# Altium schematic sheet 项目9.SchDoc
size A4
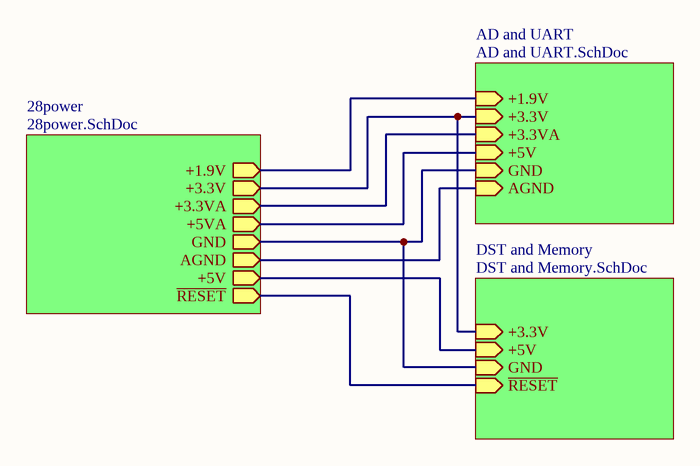
[diagram p0: 项目9.SchDoc]

## Sub-sheets
28power = 28power.SchDoc: +3.3V (out), +3.3VA (out), +5VA (out), GND (out), AGND (out), +5V (out), ~{RESET} (out), +1.9V (out)
AD and UART = AD and UART.SchDoc: +1.9V (in), +3.3V (in), +3.3VA (in), +5V (in), GND (in), AGND (in)
DST and Memory = DST and Memory.SchDoc: +3.3V (in), +5V (in), GND (in), ~{RESET} (in)

## Nets
(unnamed): sheet 28power/+3.3V, sheet AD and UART/+3.3V, sheet DST and Memory/+3.3V
(unnamed): sheet 28power/+3.3VA, sheet AD and UART/+3.3VA
(unnamed): sheet 28power/+5VA, sheet AD and UART/+5V
(unnamed): sheet 28power/GND, sheet AD and UART/GND, sheet DST and Memory/GND
(unnamed): sheet 28power/AGND, sheet AD and UART/AGND
(unnamed): sheet 28power/+5V, sheet DST and Memory/+5V
(unnamed): sheet 28power/~{RESET}, sheet DST and Memory/~{RESET}
(unnamed): sheet 28power/+1.9V, sheet AD and UART/+1.9V